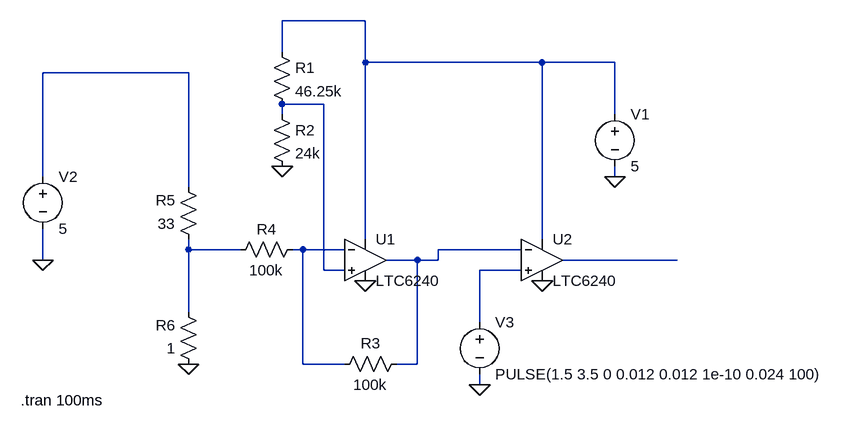
[diagram p0: schematic pwm.asc]
pwm.asc, the LTspice schematic file:
Version 4
SHEET 1 920 680
WIRE 192 -224 64 -224
WIRE 64 -176 64 -224
WIRE 192 -160 192 -224
WIRE 464 -160 192 -160
WIRE 576 -160 464 -160
WIRE -80 -144 -304 -144
WIRE 128 -96 64 -96
WIRE 64 -80 64 -96
WIRE 576 -80 576 -160
WIRE -304 16 -304 -144
WIRE 576 16 576 0
WIRE -80 32 -80 -144
WIRE 192 112 192 -160
WIRE 464 112 464 -160
WIRE -80 128 -80 112
WIRE 0 128 -80 128
WIRE 96 128 80 128
WIRE 160 128 96 128
WIRE 432 128 304 128
WIRE -304 144 -304 96
WIRE 272 144 224 144
WIRE 304 144 304 128
WIRE 304 144 272 144
WIRE 672 144 496 144
WIRE 128 160 128 -96
WIRE 160 160 128 160
WIRE 432 160 368 160
WIRE -80 224 -80 128
WIRE 368 240 368 160
WIRE 96 304 96 128
WIRE 160 304 96 304
WIRE 272 304 272 144
WIRE 272 304 240 304
WIRE 368 336 368 320
FLAG 64 0 0
FLAG 192 176 0
FLAG 464 176 0
FLAG -80 304 0
FLAG -304 144 0
FLAG 576 16 0
FLAG 368 336 0
SYMBOL Opamps\\LTC6240 192 144 R0
SYMATTR InstName U1
SYMBOL Opamps\\LTC6240 464 144 R0
SYMATTR InstName U2
SYMBOL res 48 -192 R0
SYMATTR InstName R1
SYMATTR Value 46.25k
SYMBOL res 48 -96 R0
SYMATTR InstName R2
SYMATTR Value 24k
SYMBOL res 256 288 R90
WINDOW 0 0 56 VBottom 2
WINDOW 3 32 56 VTop 2
SYMATTR InstName R3
SYMATTR Value 100k
SYMBOL res 96 112 R90
WINDOW 0 0 56 VBottom 2
WINDOW 3 32 56 VTop 2
SYMATTR InstName R4
SYMATTR Value 100k
SYMBOL res -64 128 R180
WINDOW 0 36 76 Left 2
WINDOW 3 36 40 Left 2
SYMATTR InstName R5
SYMATTR Value 33
SYMBOL res -64 320 R180
WINDOW 0 36 76 Left 2
WINDOW 3 36 40 Left 2
SYMATTR InstName R6
SYMATTR Value 1
SYMBOL voltage 576 -96 R0
WINDOW 123 0 0 Left 2
WINDOW 39 0 0 Left 2
SYMATTR InstName V1
SYMATTR Value 5
SYMBOL voltage -304 0 R0
WINDOW 123 0 0 Left 2
WINDOW 39 0 0 Left 2
SYMATTR InstName V2
SYMATTR Value 5
SYMBOL voltage 368 224 R0
WINDOW 123 0 0 Left 2
WINDOW 39 0 0 Left 2
SYMATTR InstName V3
SYMATTR Value PULSE(1.5 3.5 0 0.012 0.012 1e-10 0.024 100)
TEXT -338 360 Left 2 !.tran 100ms

The netlist it stands for:
* pwm.asc
* U1: LTC6240 (symbol Opamps\LTC6240 not available, pins judged from their places): In+=N003 In-=N005 V+=N001 V-=0 OUT=N006
* U2: LTC6240 (symbol Opamps\LTC6240 not available, pins judged from their places): In+=N008 In-=N006 V+=N001 V-=0 OUT=N007
R1 N001 N003 46.25k
R2 N003 0 24k
R3 N006 N005 100k
R4 N005 N004 100k
R5 N004 N002 33
R6 0 N004 1
V1 N001 0 5
V2 N002 0 5
V3 N008 0 PULSE(1.5 3.5 0 0.012 0.012 1e-10 0.024 100)
.tran 100ms
.backanno
.end